# Altium schematic sheet Bomba_acu.SchDoc
size Letter; Author: Paola Andrea Ayala Pineda; Organization: Altium Limited; Address1: L3, 12a Rodborough Rd; Address2: Frenchs Forest; Address3: NSW; Address4: Australia 2086; Revision: 1.0; SheetNumber: 1; SheetTotal: 5; Carnet: 19091
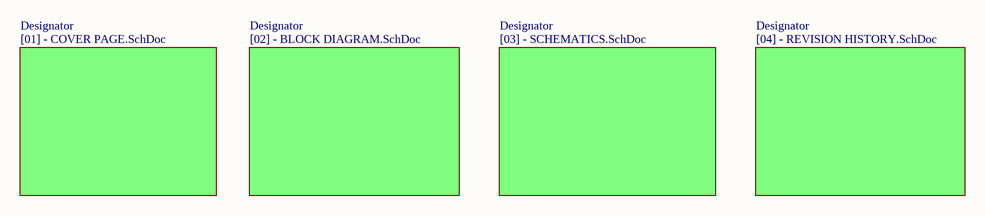
[diagram p0: Bomba_acu.SchDoc]

## Sub-sheets
Designator = [01] - COVER PAGE.SchDoc: no entries
Designator = [02] - BLOCK DIAGRAM.SchDoc: no entries
Designator = [03] - SCHEMATICS.SchDoc: no entries
Designator = [04] - REVISION HISTORY.SchDoc: no entries

## Notes on the sheet
- Proyecto:
- Documento:
- Autor:
- Carnet:
- Fecha:
- Revision:
- Tamaño:
- Carta
- Hoja:
- de